# Altium project Bad-Fox Prototype.PrjPcb
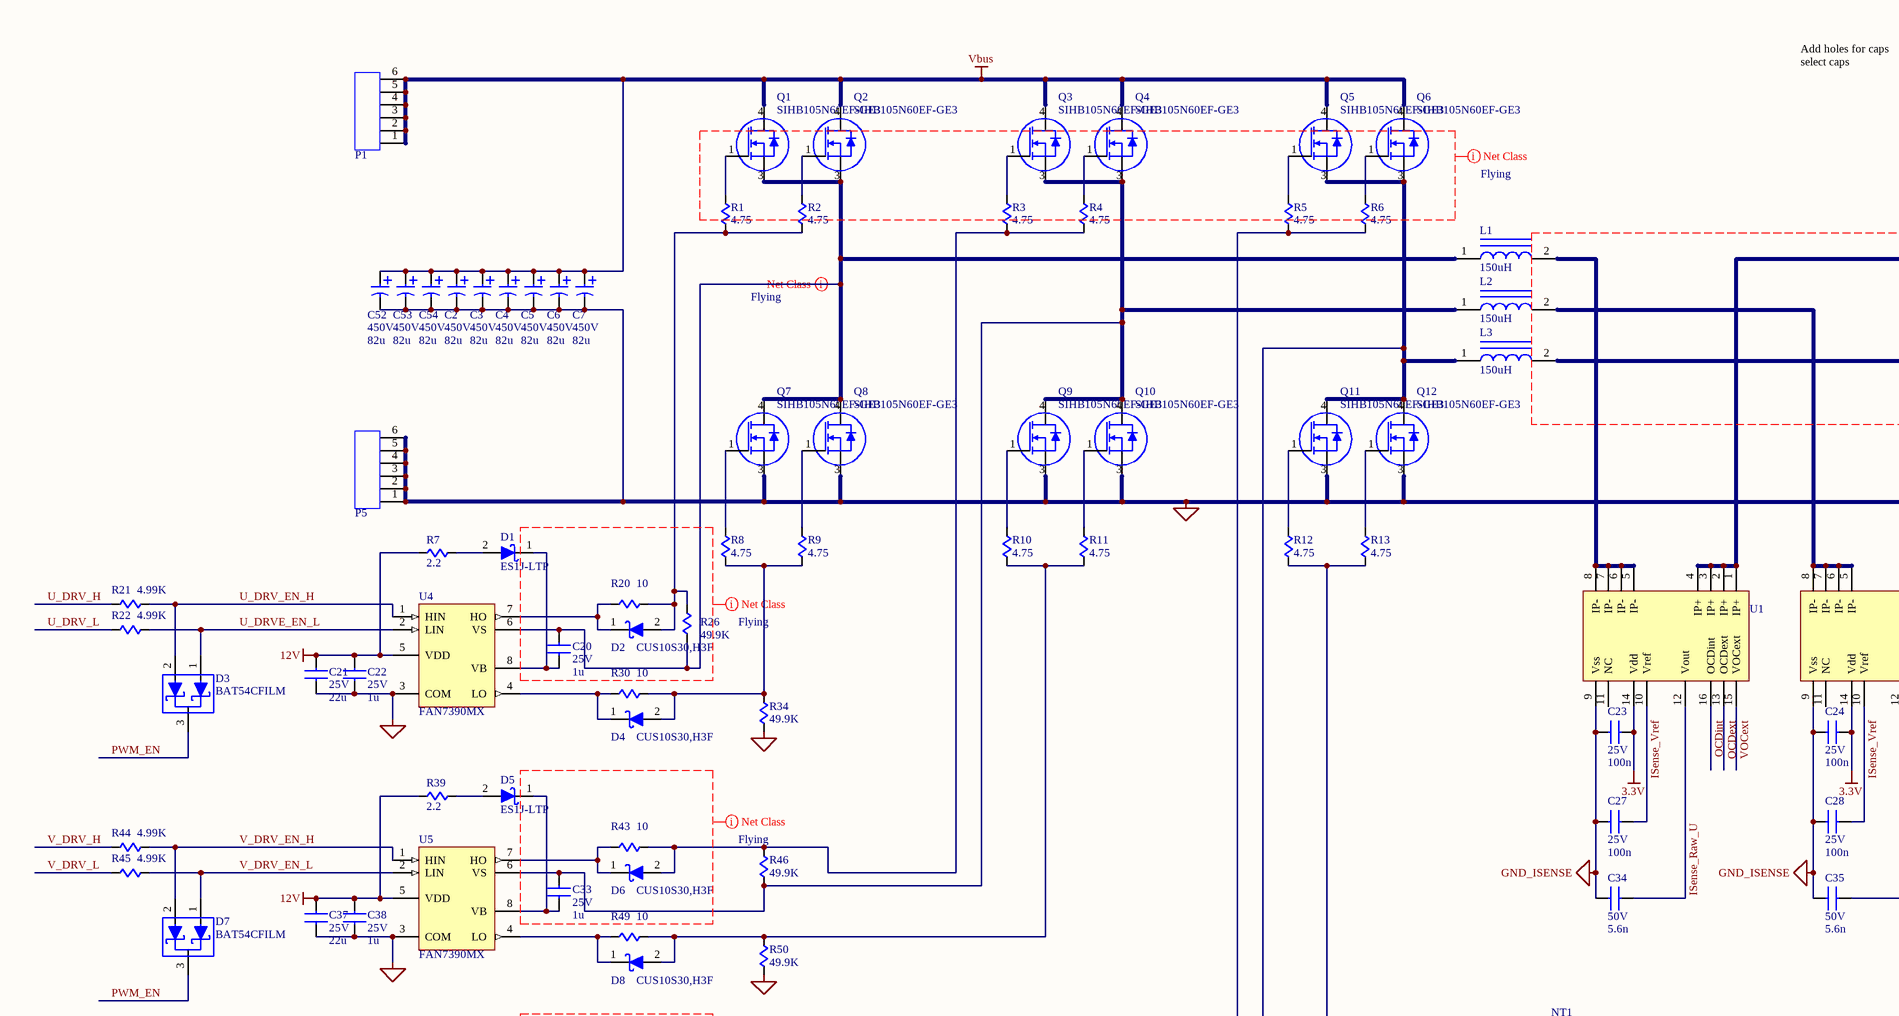
[diagram p0: Bad-Fox Prototype.SchDoc, top left]
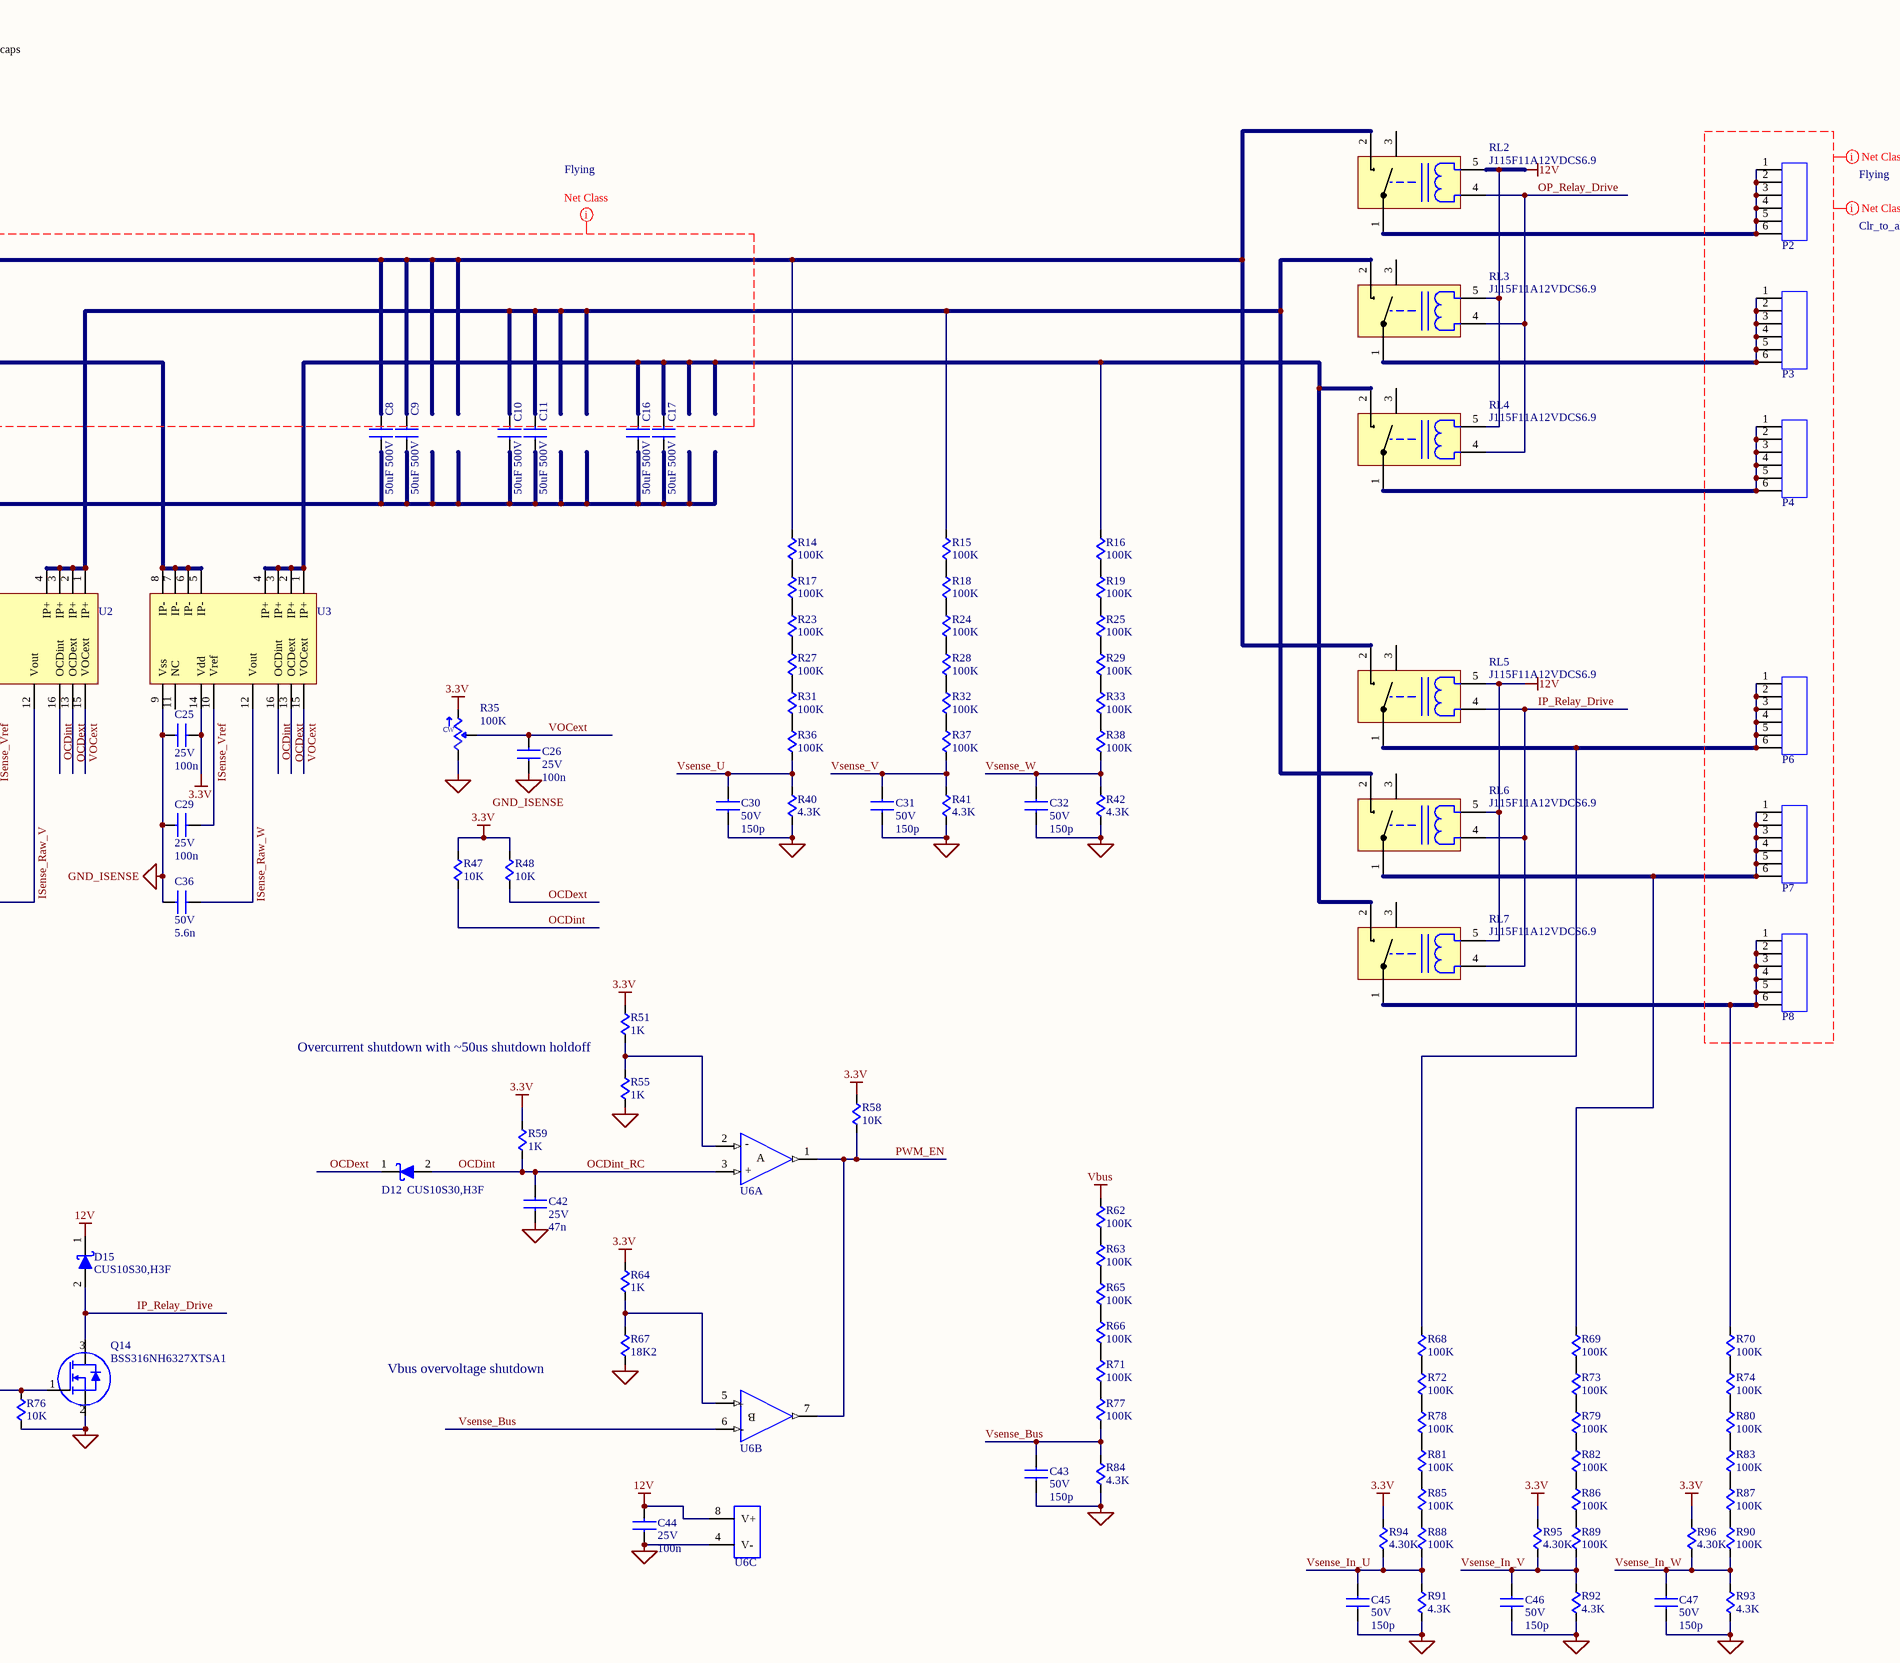
[diagram p1: Bad-Fox Prototype.SchDoc, top right]
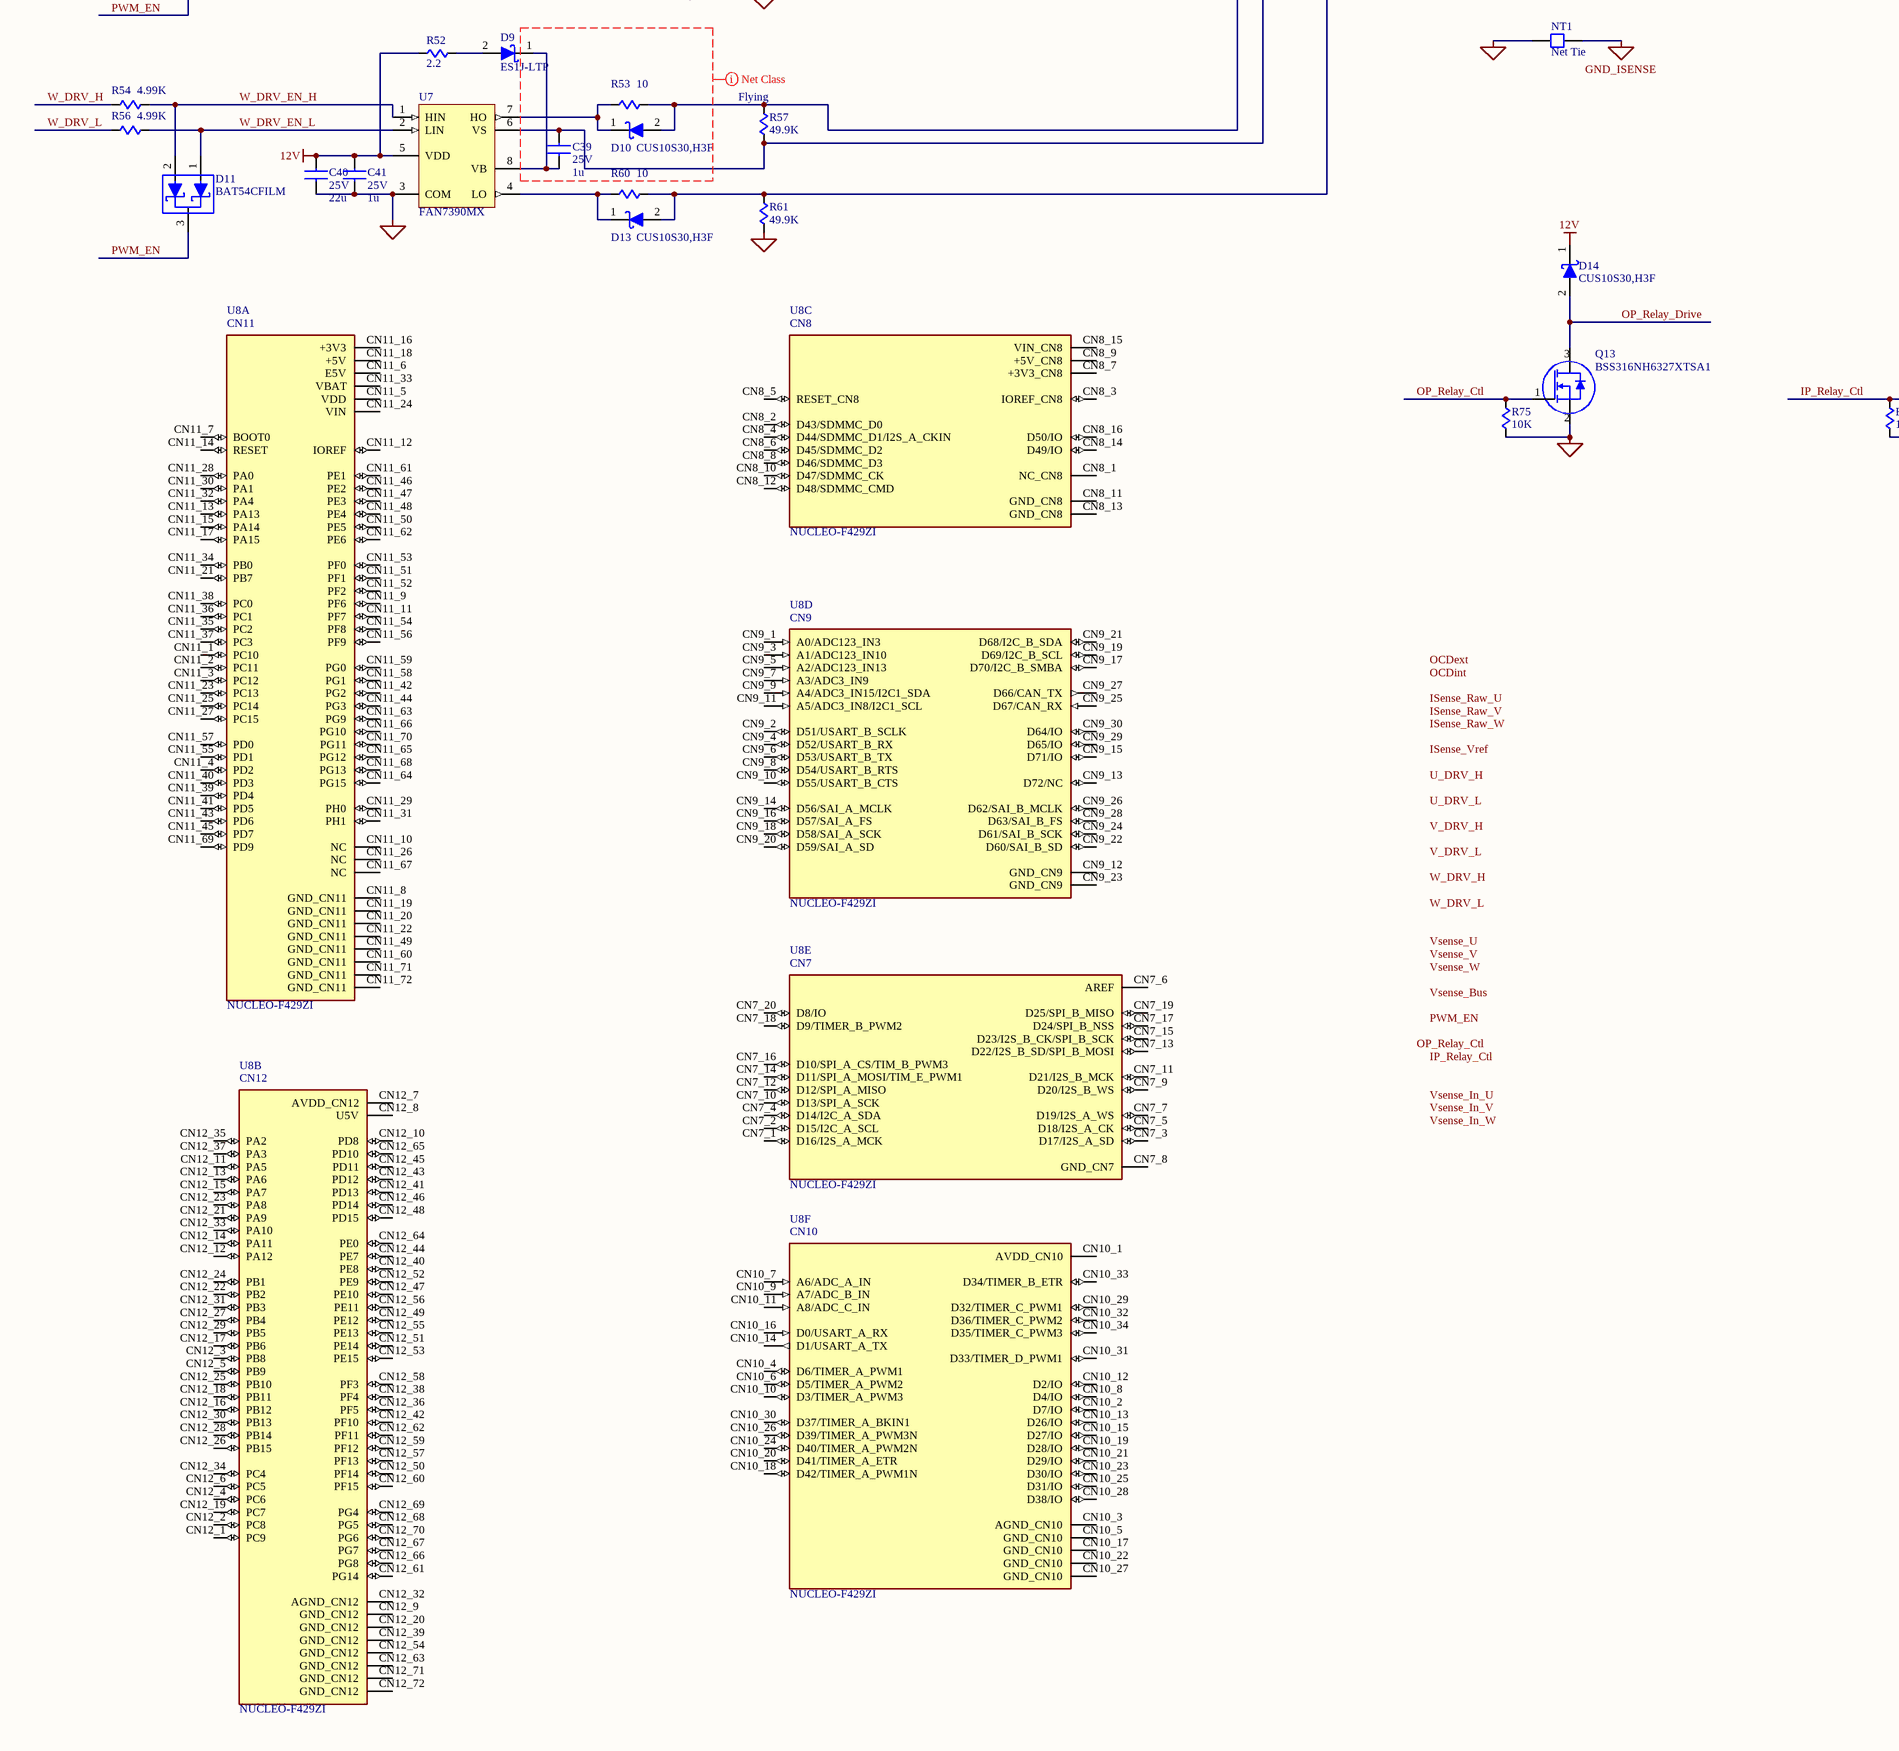
[diagram p2: Bad-Fox Prototype.SchDoc, bottom left]
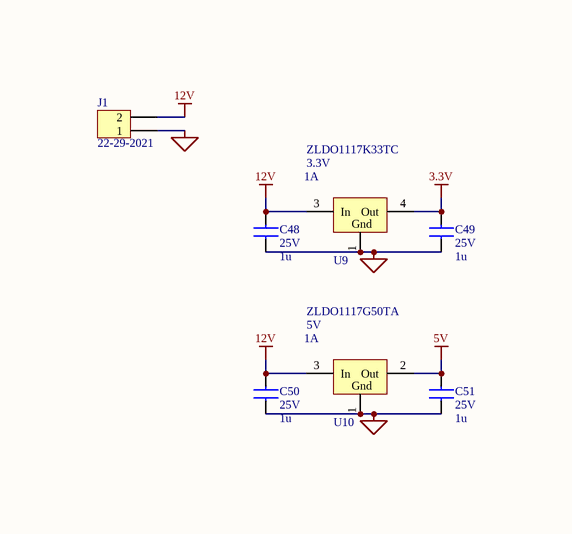
[diagram p3: Bad-Fox Prototype.SchDoc, bottom right]
1 sheet, 201 parts. Net scope: global (net labels, ports and power ports of the same name join across sheets).
Board file: Bad-Fox Prototype.PcbDoc

## Sheet Bad-Fox Prototype.SchDoc
size A1

### Parts
C2  Voltage Rating: 450V  [CAPPR7.5-18X35.5]  (hidden comment: 82u)
C3  Voltage Rating: 450V  [CAPPR7.5-18X35.5]  (hidden comment: 82u)
C4  Voltage Rating: 450V  [CAPPR7.5-18X35.5]  (hidden comment: 82u)
C5  Voltage Rating: 450V  [CAPPR7.5-18X35.5]  (hidden comment: 82u)
C6  Voltage Rating: 450V  [CAPPR7.5-18X35.5]  (hidden comment: 82u)
C7  Voltage Rating: 450V  [CAPPR7.5-18X35.5]  (hidden comment: 82u)
C8  value 50uF 500V  [C4AQ]  (hidden comment: Cap Film PP 50u 500V RADIAL)
C9  value 50uF 500V  [C4AQ]  (hidden comment: Cap Film PP 50u 500V RADIAL)
C10  value 50uF 500V  [C4AQ]  (hidden comment: Cap Film PP 50u 500V RADIAL)
C11  value 50uF 500V  [C4AQ]  (hidden comment: Cap Film PP 50u 500V RADIAL)
C16  value 50uF 500V  [C4AQ]  (hidden comment: Cap Film PP 50u 500V RADIAL)
C17  value 50uF 500V  [C4AQ]  (hidden comment: Cap Film PP 50u 500V RADIAL)
C20  Voltage Rating: 25V  [CAPC1608N-0603]  (hidden comment: 1u)
C21  Voltage Rating: 25V  [CAPC3216N-1206]  (hidden comment: 22u)
C22  Voltage Rating: 25V  [CAPC1608N-0603]  (hidden comment: 1u)
C23  Voltage Rating: 25V  [CAPC1608N-0603]  (hidden comment: 100n)
C24  Voltage Rating: 25V  [CAPC1608N-0603]  (hidden comment: 100n)
C25  Voltage Rating: 25V  [CAPC1608N-0603]  (hidden comment: 100n)
C26  Voltage Rating: 25V  [CAPC1608N-0603]  (hidden comment: 100n)
C27  Voltage Rating: 25V  [CAPC1608N-0603]  (hidden comment: 100n)
C28  Voltage Rating: 25V  [CAPC1608N-0603]  (hidden comment: 100n)
C29  Voltage Rating: 25V  [CAPC1608N-0603]  (hidden comment: 100n)
C30  Voltage Rating: 50V  [CAPC1608N-0603]  (hidden comment: 150p)
C31  Voltage Rating: 50V  [CAPC1608N-0603]  (hidden comment: 150p)
C32  Voltage Rating: 50V  [CAPC1608N-0603]  (hidden comment: 150p)
C33  Voltage Rating: 25V  [CAPC1608N-0603]  (hidden comment: 1u)
C34  Voltage Rating: 50V  [CAPC1608N-0603]  (hidden comment: 5.6n)
C35  Voltage Rating: 50V  [CAPC1608N-0603]  (hidden comment: 5.6n)
C36  Voltage Rating: 50V  [CAPC1608N-0603]  (hidden comment: 5.6n)
C37  Voltage Rating: 25V  [CAPC3216N-1206]  (hidden comment: 22u)
C38  Voltage Rating: 25V  [CAPC1608N-0603]  (hidden comment: 1u)
C39  Voltage Rating: 25V  [CAPC1608N-0603]  (hidden comment: 1u)
C40  Voltage Rating: 25V  [CAPC3216N-1206]  (hidden comment: 22u)
C41  Voltage Rating: 25V  [CAPC1608N-0603]  (hidden comment: 1u)
C42  Voltage Rating: 25V  [CAPC1608N-0603]  (hidden comment: 47n)
C43  Voltage Rating: 50V  [CAPC1608N-0603]  (hidden comment: 150p)
C44  Voltage Rating: 25V  [CAPC1608N-0603]  (hidden comment: 100n)
C45  Voltage Rating: 50V  [CAPC1608N-0603]  (hidden comment: 150p)
C46  Voltage Rating: 50V  [CAPC1608N-0603]  (hidden comment: 150p)
C47  Voltage Rating: 50V  [CAPC1608N-0603]  (hidden comment: 150p)
C48  Voltage Rating: 25V  [CAPC1608N-0603]  (hidden comment: 1u)
C49  Voltage Rating: 25V  [CAPC1608N-0603]  (hidden comment: 1u)
C50  Voltage Rating: 25V  [CAPC1608N-0603]  (hidden comment: 1u)
C51  Voltage Rating: 25V  [CAPC1608N-0603]  (hidden comment: 1u)
C52  Voltage Rating: 450V  [CAPPR7.5-18X35.5]  (hidden comment: 82u)
C53  Voltage Rating: 450V  [CAPPR7.5-18X35.5]  (hidden comment: 82u)
C54  Voltage Rating: 450V  [CAPPR7.5-18X35.5]  (hidden comment: 82u)
D1  ES1J-LTP  [DIODE SMA]
D2  CUS10S30,H3F  [SOD-323]
D3  BAT54CFILM  [SOT23-3N]
D4  CUS10S30,H3F  [SOD-323]
D5  ES1J-LTP  [DIODE SMA]
D6  CUS10S30,H3F  [SOD-323]
D7  BAT54CFILM  [SOT23-3N]
D8  CUS10S30,H3F  [SOD-323]
D9  ES1J-LTP  [DIODE SMA]
D10  CUS10S30,H3F  [SOD-323]
D11  BAT54CFILM  [SOT23-3N]
D12  CUS10S30,H3F  [SOD-323]
D13  CUS10S30,H3F  [SOD-323]
D14  CUS10S30,H3F  [SOD-323]
D15  CUS10S30,H3F  [SOD-323]
J1  22-29-2021  [CONN HEADER 2-PIN KK 6410]
L1  value 150uH  [BF_IND]  (hidden comment: Inductor for inverter charger (placeholder))
L2  value 150uH  [BF_IND]  (hidden comment: Inductor for inverter charger (placeholder))
L3  value 150uH  [BF_IND]  (hidden comment: Inductor for inverter charger (placeholder))
NT1  Net Tie  [NET TIE 50MIL]  (net tie, no BOM)
P1  Conn Screw Term PCB  [CONN SCREW TERM PCB]  (value not drawn)
P2  Conn Screw Term PCB  [CONN SCREW TERM PCB]  (value not drawn)
P3  Conn Screw Term PCB  [CONN SCREW TERM PCB]  (value not drawn)
P4  Conn Screw Term PCB  [CONN SCREW TERM PCB]  (value not drawn)
P5  Conn Screw Term PCB  [CONN SCREW TERM PCB]  (value not drawn)
P6  Conn Screw Term PCB  [CONN SCREW TERM PCB]  (value not drawn)
P7  Conn Screw Term PCB  [CONN SCREW TERM PCB]  (value not drawn)
P8  Conn Screw Term PCB  [CONN SCREW TERM PCB]  (value not drawn)
Q1  value SIHB105N60EF-GE3  [TO263]  (hidden comment: Tran N-MOSFET 600V 29A 105mOhm D2-PAK)
Q2  value SIHB105N60EF-GE3  [TO263]  (hidden comment: Tran N-MOSFET 600V 29A 105mOhm D2-PAK)
Q3  value SIHB105N60EF-GE3  [TO263]  (hidden comment: Tran N-MOSFET 600V 29A 105mOhm D2-PAK)
Q4  value SIHB105N60EF-GE3  [TO263]  (hidden comment: Tran N-MOSFET 600V 29A 105mOhm D2-PAK)
Q5  value SIHB105N60EF-GE3  [TO263]  (hidden comment: Tran N-MOSFET 600V 29A 105mOhm D2-PAK)
Q6  value SIHB105N60EF-GE3  [TO263]  (hidden comment: Tran N-MOSFET 600V 29A 105mOhm D2-PAK)
Q7  value SIHB105N60EF-GE3  [TO263]  (hidden comment: Tran N-MOSFET 600V 29A 105mOhm D2-PAK)
Q8  value SIHB105N60EF-GE3  [TO263]  (hidden comment: Tran N-MOSFET 600V 29A 105mOhm D2-PAK)
Q9  value SIHB105N60EF-GE3  [TO263]  (hidden comment: Tran N-MOSFET 600V 29A 105mOhm D2-PAK)
Q10  value SIHB105N60EF-GE3  [TO263]  (hidden comment: Tran N-MOSFET 600V 29A 105mOhm D2-PAK)
Q11  value SIHB105N60EF-GE3  [TO263]  (hidden comment: Tran N-MOSFET 600V 29A 105mOhm D2-PAK)
Q12  value SIHB105N60EF-GE3  [TO263]  (hidden comment: Tran N-MOSFET 600V 29A 105mOhm D2-PAK)
Q13  value BSS316NH6327XTSA1  [SOT23-3N]  (hidden comment: Tran N-MOSFET 30V 1.4A SOT-23)
Q14  value BSS316NH6327XTSA1  [SOT23-3N]  (hidden comment: Tran N-MOSFET 30V 1.4A SOT-23)
R1  4.75  [RESC1608N-0603]
R2  4.75  [RESC1608N-0603]
R3  4.75  [RESC1608N-0603]
R4  4.75  [RESC1608N-0603]
R5  4.75  [RESC1608N-0603]
R6  4.75  [RESC1608N-0603]
R7  2.2  [RESC1608N-0603]
R8  4.75  [RESC1608N-0603]
R9  4.75  [RESC1608N-0603]
R10  4.75  [RESC1608N-0603]
R11  4.75  [RESC1608N-0603]
R12  4.75  [RESC1608N-0603]
R13  4.75  [RESC1608N-0603]
R14  100K  [RESC1608N-0603]
R15  100K  [RESC1608N-0603]
R16  100K  [RESC1608N-0603]
R17  100K  [RESC1608N-0603]
R18  100K  [RESC1608N-0603]
R19  100K  [RESC1608N-0603]
R20  10  [RESC1608N-0603]
R21  4.99K  [RESC1608N-0603]
R22  4.99K  [RESC1608N-0603]
R23  100K  [RESC1608N-0603]
R24  100K  [RESC1608N-0603]
R25  100K  [RESC1608N-0603]
R26  49.9K  [RESC1608N-0603]
R27  100K  [RESC1608N-0603]
R28  100K  [RESC1608N-0603]
R29  100K  [RESC1608N-0603]
R30  10  [RESC1608N-0603]
R31  100K  [RESC1608N-0603]
R32  100K  [RESC1608N-0603]
R33  100K  [RESC1608N-0603]
R34  49.9K  [RESC1608N-0603]
R35  100K  [PTV09A-2020F-B104]
R36  100K  [RESC1608N-0603]
R37  100K  [RESC1608N-0603]
R38  100K  [RESC1608N-0603]
R39  2.2  [RESC1608N-0603]
R40  4.3K  [RESC1608N-0603]
R41  4.3K  [RESC1608N-0603]
R42  4.3K  [RESC1608N-0603]
R43  10  [RESC1608N-0603]
R44  4.99K  [RESC1608N-0603]
R45  4.99K  [RESC1608N-0603]
R46  49.9K  [RESC1608N-0603]
R47  10K  [RESC1608N-0603]
R48  10K  [RESC1608N-0603]
R49  10  [RESC1608N-0603]
R50  49.9K  [RESC1608N-0603]
R51  1K  [RESC1608N-0603]
R52  2.2  [RESC1608N-0603]
R53  10  [RESC1608N-0603]
R54  4.99K  [RESC1608N-0603]
R55  1K  [RESC1608N-0603]
R56  4.99K  [RESC1608N-0603]
R57  49.9K  [RESC1608N-0603]
R58  10K  [RESC1608N-0603]
R59  1K  [RESC1608N-0603]
R60  10  [RESC1608N-0603]
R61  49.9K  [RESC1608N-0603]
R62  100K  [RESC1608N-0603]
R63  100K  [RESC1608N-0603]
R64  1K  [RESC1608N-0603]
R65  100K  [RESC1608N-0603]
R66  100K  [RESC1608N-0603]
R67  value 18K2  [RESC1608N-0603]  (hidden comment: Res 18.2K 1/10W 1% 0603)
R68  100K  [RESC1608N-0603]
R69  100K  [RESC1608N-0603]
R70  100K  [RESC1608N-0603]
R71  100K  [RESC1608N-0603]
R72  100K  [RESC1608N-0603]
R73  100K  [RESC1608N-0603]
R74  100K  [RESC1608N-0603]
R75  10K  [RESC1608N-0603]
R76  10K  [RESC1608N-0603]
R77  100K  [RESC1608N-0603]
R78  100K  [RESC1608N-0603]
R79  100K  [RESC1608N-0603]
R80  100K  [RESC1608N-0603]
R81  100K  [RESC1608N-0603]
R82  100K  [RESC1608N-0603]
R83  100K  [RESC1608N-0603]
R84  4.3K  [RESC1608N-0603]
R85  100K  [RESC1608N-0603]
R86  100K  [RESC1608N-0603]
R87  100K  [RESC1608N-0603]
R88  100K  [RESC1608N-0603]
R89  100K  [RESC1608N-0603]
R90  100K  [RESC1608N-0603]
R91  4.3K  [RESC1608N-0603]
R92  4.3K  [RESC1608N-0603]
R93  4.3K  [RESC1608N-0603]
R94  value 4.30K  [RESC1608N-0603]  (hidden comment: Res 4.30K 1/10W 1% 0603)
R95  value 4.30K  [RESC1608N-0603]  (hidden comment: Res 4.30K 1/10W 1% 0603)
R96  value 4.30K  [RESC1608N-0603]  (hidden comment: Res 4.30K 1/10W 1% 0603)
RL2  value J115F11A12VDCS6.9  [T9A]  (hidden comment: Relay SPST 277VAC 40A 12Vcoil)
RL3  value J115F11A12VDCS6.9  [T9A]  (hidden comment: Relay SPST 277VAC 40A 12Vcoil)
RL4  value J115F11A12VDCS6.9  [T9A]  (hidden comment: Relay SPST 277VAC 40A 12Vcoil)
RL5  value J115F11A12VDCS6.9  [T9A]  (hidden comment: Relay SPST 277VAC 40A 12Vcoil)
RL6  value J115F11A12VDCS6.9  [T9A]  (hidden comment: Relay SPST 277VAC 40A 12Vcoil)
RL7  value J115F11A12VDCS6.9  [T9A]  (hidden comment: Relay SPST 277VAC 40A 12Vcoil)
U1  IC Sensor Current Isolated 75A  [SOIC127P1030X264-16N]  (value not drawn)
U2  IC Sensor Current Isolated 75A  [SOIC127P1030X264-16N]  (value not drawn)
U3  IC Sensor Current Isolated 75A  [SOIC127P1030X264-16N]  (value not drawn)
U4  value FAN7390MX  [SOIC127P600-8N]  (hidden comment: IC Fet Driver 4.5A Half Bridge)
U5  value FAN7390MX  [SOIC127P600-8N]  (hidden comment: IC Fet Driver 4.5A Half Bridge)
U6  IC Comparator Open Drain Dual 8-SOIC  [SOIC127P600-8N]  (value not drawn)  (parts A,B,C of 3)
U7  value FAN7390MX  [SOIC127P600-8N]  (hidden comment: IC Fet Driver 4.5A Half Bridge)
U8  NUCLEO-F429ZI  [MODULE_NUCLEO-F429ZI]  (parts A,B,C,D,E,F of 6)
U9  Voltage - Output: 3.3V  Current - Output: 1A  [TO252-229P970-3N]  (hidden comment: ZLDO1117K33TC)
U10  Voltage - Output: 5V  Current - Output: 1A  [SOT223-4N]  (hidden comment: ZLDO1117G50TA)

### Nets
3.3V: C23.1 C24.1 C25.1 C49.1 R35.3 R47.2 R48.2 R51.2 R58.2 R59.2 R64.2 R94.2 R95.2 R96.2 U1.14(Vdd) U2.14(Vdd) U3.14(Vdd) U9.4(Out)
5V: C51.1 U10.2(Out)
12V: C21.1 C22.1 C37.1 C38.1 C40.1 C41.1 C44.1 C48.1 C50.1 D14.1(Cathode) D15.1(Cathode) J1.2 R7.1 R39.1 R52.1 RL2.5 RL3.5 RL4.5 RL5.5 RL6.5 RL7.5 U4.5(VDD) U5.5(VDD) U6.8(V+) U7.5(VDD) U9.3(In) U10.3(In)
GND: C2.2 C3.2 C4.2 C5.2 C6.2 C7.2 C8.2 C9.2 C10.2 C11.2 C16.2 C17.2 C21.2 C22.2 C30.2 C31.2 C32.2 C37.2 C38.2 C40.2 C41.2 C42.2 C43.2 C44.2 C45.2 C46.2 C47.2 C48.2 C49.2 C50.2 C51.2 C52.2 C53.2 C54.2 J1.1 NT1.1 P5.1 P5.2 P5.3 P5.4 P5.5 P5.6 Q7.3(Source) Q8.3(Source) Q9.3(Source) Q10.3(Source) Q11.3(Source) Q12.3(Source) Q13.2(Source) Q14.2(Source) R34.1 R35.1 R40.1 R41.1 R42.1 R50.1 R55.1 R61.1 R67.1 R75.1 R76.1 R84.1 R91.1 R92.1 R93.1 U4.3(COM) U5.3(COM) U6.4(V-) U7.3(COM) U9.1(Gnd) U10.1(Gnd)
GND_ISENSE: C23.2 C24.2 C25.2 C26.2 C27.2 C28.2 C29.2 C34.1 C35.1 C36.1 NT1.2 U1.9(Vss) U2.9(Vss) U3.9(Vss)
Vbus: C2.1 C3.1 C4.1 C5.1 C6.1 C7.1 C52.1 C53.1 C54.1 P1.1 P1.2 P1.3 P1.4 P1.5 P1.6 Q1.4(Drain) Q2.4(Drain) Q3.4(Drain) Q4.4(Drain) Q5.4(Drain) Q6.4(Drain) R62.2
IP_Relay_Ctl: Q14.1(Gate) R76.2
IP_Relay_Drive: D15.2(Anode) Q14.3(Drain) RL5.4 RL6.4 RL7.4
ISense_Raw_U: C34.2 U1.12(Vout)
ISense_Raw_V: C35.2 U2.12(Vout)
ISense_Raw_W: C36.2 U3.12(Vout)
ISense_Vref: C27.1 C28.1 C29.1 U1.10(Vref) U2.10(Vref) U3.10(Vref)
OCDext: D12.1(Cathode) R48.1 U1.13(OCDext) U2.13(OCDext) U3.13(OCDext)
OCDint: C42.1 D12.2(Anode) R47.1 R59.1 U1.16(OCDint) U2.16(OCDint) U3.16(OCDint) U6.3(+A)  [also labelled OCDint_RC]
OP_Relay_Ctl: Q13.1(Gate) R75.2
OP_Relay_Drive: D14.2(Anode) Q13.3(Drain) RL2.4 RL3.4 RL4.4
PWM_EN: D3.3(Cathode) D7.3(Cathode) D11.3(Cathode) R58.1 U6.1(Output_A) U6.7(Output_B)
U_DRV_EN_H: D3.2(Anode2) R21.2 U4.1(HIN)
U_DRV_H: R21.1
U_DRV_L: R22.1
U_DRVE_EN_L: D3.1(Anode1) R22.2 U4.2(LIN)
V_DRV_EN_H: D7.2(Anode2) R44.2 U5.1(HIN)
V_DRV_EN_L: D7.1(Anode1) R45.2 U5.2(LIN)
V_DRV_H: R44.1
V_DRV_L: R45.1
VOCext: C26.1 R35.2 U1.15(VOCext) U2.15(VOCext) U3.15(VOCext)
Vsense_Bus: C43.1 R77.1 R84.2 U6.6(-B)
Vsense_In_U: C45.1 R88.1 R91.2 R94.1
Vsense_In_V: C46.1 R89.1 R92.2 R95.1
Vsense_In_W: C47.1 R90.1 R93.2 R96.1
Vsense_U: C30.1 R36.1 R40.2
Vsense_V: C31.1 R37.1 R41.2
Vsense_W: C32.1 R38.1 R42.2
W_DRV_EN_H: D11.2(Anode2) R54.2 U7.1(HIN)
W_DRV_EN_L: D11.1(Anode1) R56.2 U7.2(LIN)
W_DRV_H: R54.1
W_DRV_L: R56.1
NetC8_1: C8.1 C9.1 R14.2 RL2.2 RL5.2 U1.1(IP+) U1.2(IP+) U1.3(IP+) U1.4(IP+)
NetC10_1: C10.1 C11.1 R15.2 RL3.2 RL6.2 U2.1(IP+) U2.2(IP+) U2.3(IP+) U2.4(IP+)
NetC16_1: C16.1 C17.1 R16.2 RL4.2 RL7.2 U3.1(IP+) U3.2(IP+) U3.3(IP+) U3.4(IP+)
NetC20_1: C20.1 D1.1(Cathode) U4.8(VB)
NetC20_2: C20.2 L1.1 Q1.3(Source) Q2.3(Source) Q7.4(Drain) Q8.4(Drain) R26.1 U4.6(VS)
NetC33_1: C33.1 D5.1(Cathode) U5.8(VB)
NetC33_2: C33.2 L2.1 Q3.3(Source) Q4.3(Source) Q9.4(Drain) Q10.4(Drain) R46.1 U5.6(VS)
NetC39_1: C39.1 D9.1(Cathode) U7.8(VB)
NetC39_2: C39.2 L3.1 Q5.3(Source) Q6.3(Source) Q11.4(Drain) Q12.4(Drain) R57.1 U7.6(VS)
NetD1_2: D1.2(Anode) R7.2
NetD2_1: D2.1(Cathode) R20.1 U4.7(HO)
NetD2_2: D2.2(Anode) R1.2 R2.2 R20.2 R26.2
NetD4_1: D4.1(Cathode) R30.1 U4.4(LO)
NetD4_2: D4.2(Anode) R8.2 R9.2 R30.2 R34.2
NetD5_2: D5.2(Anode) R39.2
NetD6_1: D6.1(Cathode) R43.1 U5.7(HO)
NetD6_2: D6.2(Anode) R3.2 R4.2 R43.2 R46.2
NetD8_1: D8.1(Cathode) R49.1 U5.4(LO)
NetD8_2: D8.2(Anode) R10.2 R11.2 R49.2 R50.2
NetD9_2: D9.2(Anode) R52.2
NetD10_1: D10.1(Cathode) R53.1 U7.7(HO)
NetD10_2: D10.2(Anode) R5.2 R6.2 R53.2 R57.2
NetD13_1: D13.1(Cathode) R60.1 U7.4(LO)
NetD13_2: D13.2(Anode) R12.2 R13.2 R60.2 R61.2
NetL1_2: L1.2 U1.5(IP-) U1.6(IP-) U1.7(IP-) U1.8(IP-)
NetL2_2: L2.2 U2.5(IP-) U2.6(IP-) U2.7(IP-) U2.8(IP-)
NetL3_2: L3.2 U3.5(IP-) U3.6(IP-) U3.7(IP-) U3.8(IP-)
NetP2_1: P2.1 P2.2 P2.3 P2.4 P2.5 P2.6 RL2.1
NetP3_1: P3.1 P3.2 P3.3 P3.4 P3.5 P3.6 RL3.1
NetP4_1: P4.1 P4.2 P4.3 P4.4 P4.5 P4.6 RL4.1
NetP6_1: P6.1 P6.2 P6.3 P6.4 P6.5 P6.6 R68.2 RL5.1
NetP7_1: P7.1 P7.2 P7.3 P7.4 P7.5 P7.6 R69.2 RL6.1
NetP8_1: P8.1 P8.2 P8.3 P8.4 P8.5 P8.6 R70.2 RL7.1
NetQ1_1: Q1.1(Gate) R1.1
NetQ2_1: Q2.1(Gate) R2.1
NetQ3_1: Q3.1(Gate) R3.1
NetQ4_1: Q4.1(Gate) R4.1
NetQ5_1: Q5.1(Gate) R5.1
NetQ6_1: Q6.1(Gate) R6.1
NetQ7_1: Q7.1(Gate) R8.1
NetQ8_1: Q8.1(Gate) R9.1
NetQ9_1: Q9.1(Gate) R10.1
NetQ10_1: Q10.1(Gate) R11.1
NetQ11_1: Q11.1(Gate) R12.1
NetQ12_1: Q12.1(Gate) R13.1
NetR14_1: R14.1 R17.2
NetR15_1: R15.1 R18.2
NetR16_1: R16.1 R19.2
NetR17_1: R17.1 R23.2
NetR18_1: R18.1 R24.2
NetR19_1: R19.1 R25.2
NetR23_1: R23.1 R27.2
NetR24_1: R24.1 R28.2
NetR25_1: R25.1 R29.2
NetR27_1: R27.1 R31.2
NetR28_1: R28.1 R32.2
NetR29_1: R29.1 R33.2
NetR31_1: R31.1 R36.2
NetR32_1: R32.1 R37.2
NetR33_1: R33.1 R38.2
NetR51_1: R51.1 R55.2 U6.2(-A)
NetR62_1: R62.1 R63.2
NetR63_1: R63.1 R65.2
NetR64_1: R64.1 R67.2 U6.5(+B)
NetR65_1: R65.1 R66.2
NetR66_1: R66.1 R71.2
NetR68_1: R68.1 R72.2
NetR69_1: R69.1 R73.2
NetR70_1: R70.1 R74.2
NetR71_1: R71.1 R77.2
NetR72_1: R72.1 R78.2
NetR73_1: R73.1 R79.2
NetR74_1: R74.1 R80.2
NetR78_1: R78.1 R81.2
NetR79_1: R79.1 R82.2
NetR80_1: R80.1 R83.2
NetR81_1: R81.1 R85.2
NetR82_1: R82.1 R86.2
NetR83_1: R83.1 R87.2
NetR85_1: R85.1 R88.2
NetR86_1: R86.1 R89.2
NetR87_1: R87.1 R90.2

Not connected (* = marked no-connect by the designer): RL2 3; RL3 3; RL4 3; RL5 3; RL6 3; RL7 3; U1 11(NC); U2 11(NC); U3 11(NC); U8 CN7_1(D16/I2S_A_MCK) CN7_2(D15/I2C_A_SCL) CN7_3(D17/I2S_A_SD) CN7_4(D14/I2C_A_SDA) CN7_5(D18/I2S_A_CK) CN7_6(AREF) CN7_7(D19/I2S_A_WS) CN7_8(GND_CN7) CN7_9(D20/I2S_B_WS) CN7_10(D13/SPI_A_SCK) CN7_11(D21/I2S_B_MCK) CN7_12(D12/SPI_A_MISO) CN7_13(D22/I2S_B_SD/SPI_B_MOSI) CN7_14(D11/SPI_A_MOSI/TIM_E_PWM1) CN7_15(D23/I2S_B_CK/SPI_B_SCK) CN7_16(D10/SPI_A_CS/TIM_B_PWM3) CN7_17(D24/SPI_B_NSS) CN7_18(D9/TIMER_B_PWM2) CN7_19(D25/SPI_B_MISO) CN7_20(D8/IO) CN8_1(NC_CN8) CN8_2(D43/SDMMC_D0) CN8_3(IOREF_CN8) CN8_4(D44/SDMMC_D1/I2S_A_CKIN) CN8_5(RESET_CN8) CN8_6(D45/SDMMC_D2) CN8_7(+3V3_CN8) CN8_8(D46/SDMMC_D3) CN8_9(+5V_CN8) CN8_10(D47/SDMMC_CK) CN8_11(GND_CN8) CN8_12(D48/SDMMC_CMD) CN8_13(GND_CN8) CN8_14(D49/IO) CN8_15(VIN_CN8) CN8_16(D50/IO) CN9_1(A0/ADC123_IN3) CN9_2(D51/USART_B_SCLK) CN9_3(A1/ADC123_IN10) CN9_4(D52/USART_B_RX) CN9_5(A2/ADC123_IN13) CN9_6(D53/USART_B_TX) CN9_7(A3/ADC3_IN9) CN9_8(D54/USART_B_RTS) CN9_9(A4/ADC3_IN15/I2C1_SDA) CN9_10(D55/USART_B_CTS) CN9_11(A5/ADC3_IN8/I2C1_SCL) CN9_12(GND_CN9) CN9_13(D72/NC) CN9_14(D56/SAI_A_MCLK) CN9_15(D71/IO) CN9_16(D57/SAI_A_FS) CN9_17(D70/I2C_B_SMBA) CN9_18(D58/SAI_A_SCK) CN9_19(D69/I2C_B_SCL) CN9_20(D59/SAI_A_SD) CN9_21(D68/I2C_B_SDA) CN9_22(D60/SAI_B_SD) CN9_23(GND_CN9) CN9_24(D61/SAI_B_SCK) CN9_25(D67/CAN_RX) CN9_26(D62/SAI_B_MCLK) CN9_27(D66/CAN_TX) CN9_28(D63/SAI_B_FS) CN9_29(D65/IO) CN9_30(D64/IO) CN10_1(AVDD_CN10) CN10_2(D7/IO) CN10_3(AGND_CN10) CN10_4(D6/TIMER_A_PWM1) CN10_5(GND_CN10) CN10_6(D5/TIMER_A_PWM2) CN10_7(A6/ADC_A_IN) CN10_8(D4/IO) CN10_9(A7/ADC_B_IN) CN10_10(D3/TIMER_A_PWM3) CN10_11(A8/ADC_C_IN) CN10_12(D2/IO) CN10_13(D26/IO) CN10_14(D1/USART_A_TX) CN10_15(D27/IO) CN10_16(D0/USART_A_RX) CN10_17(GND_CN10) CN10_18(D42/TIMER_A_PWM1N) CN10_19(D28/IO) CN10_20(D41/TIMER_A_ETR) CN10_21(D29/IO) CN10_22(GND_CN10) CN10_23(D30/IO) CN10_24(D40/TIMER_A_PWM2N) CN10_25(D31/IO) CN10_26(D39/TIMER_A_PWM3N) CN10_27(GND_CN10) CN10_28(D38/IO) CN10_29(D32/TIMER_C_PWM1) CN10_30(D37/TIMER_A_BKIN1) CN10_31(D33/TIMER_D_PWM1) CN10_32(D36/TIMER_C_PWM2) CN10_33(D34/TIMER_B_ETR) CN10_34(D35/TIMER_C_PWM3) CN11_1(PC10) CN11_2(PC11) CN11_3(PC12) CN11_4(PD2) CN11_5(VDD) CN11_6(E5V) CN11_7(BOOT0) CN11_8(GND_CN11) CN11_9(PF6) CN11_10(NC) CN11_11(PF7) CN11_12(IOREF) CN11_13(PA13) CN11_14(RESET) CN11_15(PA14) CN11_16(+3V3) CN11_17(PA15) CN11_18(+5V) CN11_19(GND_CN11) CN11_20(GND_CN11) CN11_21(PB7) CN11_22(GND_CN11) CN11_23(PC13) CN11_24(VIN) CN11_25(PC14) CN11_26(NC) CN11_27(PC15) CN11_28(PA0) CN11_29(PH0) CN11_30(PA1) CN11_31(PH1) CN11_32(PA4) CN11_33(VBAT) CN11_34(PB0) CN11_35(PC2) CN11_36(PC1) CN11_37(PC3) CN11_38(PC0) CN11_39(PD4) CN11_40(PD3) CN11_41(PD5) CN11_42(PG2) CN11_43(PD6) CN11_44(PG3) CN11_45(PD7) CN11_46(PE2) CN11_47(PE3) CN11_48(PE4) CN11_49(GND_CN11) CN11_50(PE5) CN11_51(PF1) CN11_52(PF2) CN11_53(PF0) CN11_54(PF8) CN11_55(PD1) CN11_56(PF9) CN11_57(PD0) CN11_58(PG1) CN11_59(PG0) CN11_60(GND_CN11) CN11_61(PE1) CN11_62(PE6) CN11_63(PG9) CN11_64(PG15) CN11_65(PG12) CN11_66(PG10) CN11_67(NC) CN11_68(PG13) CN11_69(PD9) CN11_70(PG11) CN11_71(GND_CN11) CN11_72(GND_CN11) CN12_1(PC9) CN12_2(PC8) CN12_3(PB8) CN12_4(PC6) CN12_5(PB9) CN12_6(PC5) CN12_7(AVDD_CN12) CN12_8(U5V) CN12_9(GND_CN12) CN12_10(PD8) CN12_11(PA5) CN12_12(PA12) CN12_13(PA6) CN12_14(PA11) CN12_15(PA7) CN12_16(PB12) CN12_17(PB6) CN12_18(PB11) CN12_19(PC7) CN12_20(GND_CN12) CN12_21(PA9) CN12_22(PB2) CN12_23(PA8) CN12_24(PB1) CN12_25(PB10) CN12_26(PB15) CN12_27(PB4) CN12_28(PB14) CN12_29(PB5) CN12_30(PB13) CN12_31(PB3) CN12_32(AGND_CN12) CN12_33(PA10) CN12_34(PC4) CN12_35(PA2) CN12_36(PF5) CN12_37(PA3) CN12_38(PF4) CN12_39(GND_CN12) CN12_40(PE8) CN12_41(PD13) CN12_42(PF10) CN12_43(PD12) CN12_44(PE7) CN12_45(PD11) CN12_46(PD14) CN12_47(PE10) CN12_48(PD15) CN12_49(PE12) CN12_50(PF14) CN12_51(PE14) CN12_52(PE9) CN12_53(PE15) CN12_54(GND_CN12) CN12_55(PE13) CN12_56(PE11) CN12_57(PF13) CN12_58(PF3) CN12_59(PF12) CN12_60(PF15) CN12_61(PG14) CN12_62(PF11) CN12_63(GND_CN12) CN12_64(PE0) CN12_65(PD10) CN12_66(PG8) CN12_67(PG7) CN12_68(PG5) CN12_69(PG4) CN12_70(PG6) CN12_71(GND_CN12) CN12_72(GND_CN12)

### Layout directives
net class Flying: (no net found under the mark), NetC20_2
net class Clr_to_all: (no net found under the mark)

### Notes on the sheet
- Add holes for caps
  select caps
- (near R51) Overcurrent shutdown with ~50us shutdown holdoff
- Vbus overvoltage shutdown
- Labels drawn without touching a wire or pin: IP_Relay_Ctl, ISense_Raw_U, ISense_Raw_V, ISense_Raw_W, ISense_Vref, OCDext, OCDint, OP_Relay_Ctl, PWM_EN, U_DRV_H, U_DRV_L, V_DRV_H, V_DRV_L, Vsense_Bus, Vsense_In_U, Vsense_In_V, Vsense_In_W, Vsense_U, Vsense_V, Vsense_W, W_DRV_H, W_DRV_L
- (in symbol NUCLEO-F429ZI, part A) CN11
- (in symbol NUCLEO-F429ZI, part B) CN12
- (in symbol NUCLEO-F429ZI, part C) CN8
- (in symbol NUCLEO-F429ZI, part D) CN9
- (in symbol NUCLEO-F429ZI, part E) CN7
- (in symbol NUCLEO-F429ZI, part F) CN10
- (in symbol PTV09A-2020F-B104) CW
- (in symbol TLC393IDR, part A) -; A; +
- (in symbol TLC393IDR, part B) +; B; -

### Library data of the parts
C2-C7 C52-C54 = EKXG451ELL820MMP1S: CAP, 82u, 450V, ±20%, Alu, Pol, RADIAL, THT; Manufacturer: United Chemi-Con; Manufacturer Part Number: EKXG451ELL820MMP1S; Value: 82u; Supplier 1: Digikey; Supplier Part Number 1: 565-1480-ND; Tolerance: ±20%; Temperature Coefficient: Alu, Pol; Operating Temperature: -25°C ~ 105°C; Price: 2.9; HelpURL: http://www.chemi-con.co.jp/cgi-bin/CAT_DB/SEARCH/cat_db_al.cgi?e=e&j=p&pdfname=kxg
C8-C11 C16 C17 = C4AQLBW5500A3JK: Dist: Digi-Key; Dist P/N: 399-17001-ND; Mfg: Kemet; Mfgr P/N: C4AQLBW5500A3JK; Price: 10.35; HelpURL: https://katalog.we-online.de/pbs/datasheet/885012206089.pdf
C20 C22 C33 C38 C39 C41 C48-C51 = C1608X5R1E105K: CAP, 1u, 25V, ±10%, X5R, 0603; Manufacturer: TDK; Manufacturer Part Number: C1608X5R1E105K; Value: 1u; Supplier 1: Digikey; Supplier Part Number 1: 445-5146-1-ND; Tolerance: ±10%; Temperature Coefficient: X5R; Operating Temperature: -55°C ~ 85°C; Price: 0.07; HelpURL: https://product.tdk.com/info/en/catalog/datasheets/mlcc_commercial_general_en.pdf?ref_disty=digikey
C21 C37 C40 = CL31A226KAHNNNE: CAP, 22u, 25V, ±10%, X5R, 1206; Manufacturer: Samsung; Manufacturer Part Number: CL31A226KAHNNNE; Value: 22u; Supplier 1: Digikey; Supplier Part Number 1: 1276-3047-1-ND; Tolerance: ±10%; Temperature Coefficient: X5R; Operating Temperature: -55°C ~ 85°C; Price: 0.27; HelpURL: https://media.digikey.com/pdf/Data%20Sheets/Samsung%20PDFs/CL31A226KAHNNNE_Spec.pdf
C23-C29 C44 = C0603C104K3RACTU: CAP, 100n, 25V, ±10%, X7R, 0603; Manufacturer: Kemet; Manufacturer Part Number: C0603C104K3RACTU; Value: 100n; Supplier 1: Digikey; Supplier Part Number 1: 399-1281-1-ND; Tolerance: ±10%; Temperature Coefficient: X7R; Operating Temperature: -55°C ~ 125°C; Price: 0.06; HelpURL: https://api.kemet.com/component-edge/download/datasheet/C0603C104K3RACTU.pdf
C30-C32 C43 C45-C47 = C1608C0G1H151J: CAP, 150p, 50V, ±5%, C0G, NP0, 0603, (EOL); Manufacturer: TDK; Manufacturer Part Number: C1608C0G1H151J; Value: 150p; Supplier 1: Digikey; Supplier Part Number 1: 445-1283-1-ND; Tolerance: ±5%; Temperature Coefficient: C0G, NP0; Operating Temperature: -55°C ~ 125°C; HelpURL: https://product.tdk.com/info/en/catalog/datasheets/mlcc_commercial_general_en.pdf?ref_disty=digikey
C34-C36 = 06035C562KAT2A: CAP, 5.6n, 50V, ±10%, X7R, 0603; Manufacturer: AVX; Manufacturer Part Number: 06035C562KAT2A; Value: 5.6n; Supplier 1: Digikey; Supplier Part Number 1: 478-1224-1-ND; Tolerance: ±10%; Temperature Coefficient: X7R; Operating Temperature: -55°C ~ 125°C; Price: 0.05; HelpURL: http://datasheets.avx.com/X7RDielectric.pdf
C42 = CC0603KRX7R8BB473: CAP, 47n, 25V, ±10%, X7R, 0603; Manufacturer: Yageo; Manufacturer Part Number: CC0603KRX7R8BB473; Value: 47n; Supplier 1: Digikey; Supplier Part Number 1: 311-1373-1-ND; Tolerance: ±10%; Temperature Coefficient: X7R; Operating Temperature: -55°C ~ 125°C; Price: 0.03; HelpURL: https://www.yageo.com/upload/media/product/productsearch/datasheet/mlcc/UPY-GPHC_X7R_6.3V-to-50V_18.pdf
D1 D5 D9 = VSSAF510-M3/H: DIO, SCHOTTKY, 600V, 1A, SMA; Manufacturer: Vishay; Manufacturer Part Number: ES1J-LTP; Value: ES1J-LTP; Supplier 1: Digikey; Supplier Part Number 1: ES1J-LTPMSCT-ND; Voltage - DC Reverse (Max): 600V; Current: 1A; Operating Temperature: -40°C ~ 150°C; Price: 0.28; HelpURL: https://www.mccsemi.com/pdf/Products/ES1A-L-ES1J-L(DO-214AC).pdf
D2 D4 D6 D8 D10 D12-D15 = CUS10S30,H3F: DIO, SCHOTTKY, 30V, 1A, SOD-323; Manufacturer: Toshiba Semiconductor and Storage; Manufacturer Part Number: CUS10S30,H3F; Value: CUS10S30,H3F; Supplier 1: Digikey; Supplier Part Number 1: CUS10S30H3FTR-ND; Voltage - DC Reverse (Max): 30V; Current: 1A; Operating Temperature: 125°C; Price: 0.18; HelpURL: https://toshiba.semicon-storage.com/info/docget.jsp?did=14077&prodName=CUS10S30
D3 D7 D11 = BAT54CFILM: DIO, SCHOTTKY, CC, 40V, 300mA, SOT-23-3; Manufacturer: ST; Reverse Recovery Time (trr): 5ns; Manufacturer Part Number: BAT54CFILM; Value: BAT54CFILM; Supplier 1: Digikey; Supplier Part Number 1: 497-3786-2-ND; Voltage - DC Reverse (Max): 40V; Current: 300mA; Operating Temperature: -40°C ~ 150°C; Price: 0.19; HelpURL: https://www.st.com/content/ccc/resource/technical/document/datasheet/07/50/54/f2/0d/ba/4a/79/CD00001322.pdf/files/CD00001322.pdf/jcr:content/translations/en.CD00001322.pdf
J1 = 22-29-2021: CONN, HEADER, 2-POS, 2.54mm, TH; Manufacturer: Molex; Number of Positions: 2; Voltage - Rated: 500V; Current Rating: 4A; Manufacturer Part Number: 22-29-2021; Value: 22-29-2021; Supplier 1: Digikey; Supplier Part Number 1: WM2744-ND; Pitch: 2.54mm; Number of Rows: 1; Price: 0.45; HelpURL: https://www.molex.com/pdm_docs/sd/022292021_sd.pdf
L1-L3 = BF-IND: Dist: -; Dist P/N: -; Mfg: -; Mfgr P/N: -; Price: -; HelpURL: -
P1-P8 = Conn Screw Term PCB: Mfg Part Number: 8196; Supplier Part Number: *; Price: *
Q1-Q12 = AOB290L: Dist: Digi-Key; Dist P/N: 742-SIHB105N60EF-GE3-ND; Mfg: Vishay; Mfgr P/N: SIHB105N60EF-GE3; Price: 3.00; Datasheet: https://www.vishay.com/docs/92302/sihb105n60ef.pdf
Q13 Q14 = BSS316NH6327XTSA1: Dist: Digi-Key; Dist P/N: BSS316NH6327XTSA1CT-ND; Mfg: Infineon Technologies; Mfgr P/N: BSS316NH6327XTSA1; Price: 0.62; HelpURL: https://www.infineon.com/dgdl/BSS316N_Rev2.3.pdf?folderId=db3a3043156fd573011622e10b5c1f67&fileId=db3a304330f686060130ff7ee4b07f16
R1-R6 R8-R13 = RC0603FR-074R75L: RES, 4.75R, 0.1W, 1%, 0603; Manufacturer: Yageo; Tolerance: 1.00%; Temperature Coefficient: ±200ppm/°C; Manufacturer Part Number: RC0603FR-074R75L; Value: 4.75; Supplier 1: Digikey; Supplier Part Number 1: 311-4.75HRTR-ND; Power: 0.1W; Operating Temperature: -55°C ~ 155°C; Price: 0.03; HelpURL: https://www.yageo.com/upload/media/product/productsearch/datasheet/rchip/PYu-RC_Group_51_RoHS_L_10.pdf
R7 R39 R52 = ERJ-3RQF2R2V: RES, 2.2R, 0.1W, 1%, 0603; Manufacturer: Panasonic; Tolerance: 1.00%; Temperature Coefficient: ±200ppm/°C; Manufacturer Part Number: ERJ-3RQF2R2V; Value: 2.2; Supplier 1: Digikey; Supplier Part Number 1: P2.2AJTR-ND; Power: 0.1W; Operating Temperature: -55°C ~ 155°C; Price: 0.09; HelpURL: https://industrial.panasonic.com/cdbs/www-data/pdf/RDN0000/AOA0000C313.pdf
R14-R19 R23-R25 R27-R29 R31-R33 R36-R38 R62 R63 R65 R66 R68-R74 R77-R83 R85-R90 = ERJ-3EKF1003V: RES, 100K, 0.1W, 1%, 0603; Manufacturer: Panasonic; Tolerance: 1.00%; Temperature Coefficient: ±100ppm/°C; Manufacturer Part Number: ERJ-3EKF1003V; Value: 100K; Supplier 1: Digikey; Supplier Part Number 1: P100KHTR-ND; Power: 0.1W; Operating Temperature: -55°C ~ 155°C; Price: 0.02; HelpURL: https://industrial.panasonic.com/cdbs/www-data/pdf/RDA0000/AOA0000C304.pdf
R20 R30 R43 R49 R53 R60 = ERJ-3EKF10R0V: RES, 10R, 0.1W, 1%, 0603; Manufacturer: Panasonic; Tolerance: 1.00%; Temperature Coefficient: ±100ppm/°C; Manufacturer Part Number: ERJ-3EKF10R0V; Value: 10; Supplier 1: Digikey; Supplier Part Number 1: P10.0HTR-ND; Power: 0.1W; Operating Temperature: -55°C ~ 155°C; Price: 0.02; HelpURL: https://industrial.panasonic.com/cdbs/www-data/pdf/RDA0000/AOA0000C304.pdf
R21 R22 R44 R45 R54 R56 = ERJ-3EKF4991V: RES, 4.99K, 0.1W, 1%, 0603; Manufacturer: Panasonic; Tolerance: 1.00%; Temperature Coefficient: ±100ppm/°C; Manufacturer Part Number: ERJ-3EKF4991V; Value: 4.99K; Supplier 1: Digikey; Supplier Part Number 1: P4.99KHTR-ND; Power: 0.1W; Operating Temperature: -55°C ~ 155°C; Price: 0.02; HelpURL: https://industrial.panasonic.com/cdbs/www-data/pdf/RDA0000/AOA0000C304.pdf
R26 R34 R46 R50 R57 R61 = ERJ-3EKF4992V: RES, 49.9K, 0.1W, 1%, 0603; Manufacturer: Panasonic; Tolerance: 1.00%; Temperature Coefficient: ±100ppm/°C; Manufacturer Part Number: ERJ-3EKF4992V; Value: 49.9K; Supplier 1: Digikey; Supplier Part Number 1: P49.9KHTR-ND; Power: 0.1W; Operating Temperature: -55°C ~ 155°C; Price: 0.02; HelpURL: https://industrial.panasonic.com/cdbs/www-data/pdf/RDA0000/AOA0000C304.pdf
R35 = PTV09A-2020F-B104: RES, POT, 100K, 50mW, Linear, THT; Manufacturer: Bourns Inc.; Tolerance: 20.00%; Manufacturer Part Number: PTV09A-2020F-B104; Value: 100K; Supplier 1: Digikey; Supplier Part Number 1: PTV09A-2020F-B104-ND; Power: 50mW; Price: 0.87; HelpURL: https://www.bourns.com/docs/Product-Datasheets/PTV09.pdf
R40-R42 R84 R91-R93 = ERJ-3EKF4301V: RES, 4.3K, 0.1W, 1%, 0603; Manufacturer: Panasonic; Tolerance: 1.00%; Temperature Coefficient: ±100ppm/°C; Manufacturer Part Number: ERJ-3EKF4301V; Value: 4.3K; Supplier 1: Digikey; Supplier Part Number 1: P4.30KHTR-ND; Power: 0.1W; Operating Temperature: -55°C ~ 155°C; Price: 0.02; HelpURL: https://industrial.panasonic.com/cdbs/www-data/pdf/RDA0000/AOA0000C304.pdf
R47 R48 R58 R75 R76 = ERJ-3EKF1002V: RES, 10K, 0.1W, 1%, 0603; Manufacturer: Panasonic; Tolerance: 1.00%; Temperature Coefficient: ±100ppm/°C; Manufacturer Part Number: ERJ-3EKF1002V; Value: 10K; Supplier 1: Digikey; Supplier Part Number 1: P10.0KHTR-ND; Power: 0.1W; Operating Temperature: -55°C ~ 155°C; Price: 0.02; HelpURL: https://industrial.panasonic.com/cdbs/www-data/pdf/RDA0000/AOA0000C304.pdf
R51 R55 R59 R64 = ERJ-3EKF1001V: RES, 1K, 0.1W, 1%, 0603; Manufacturer: Panasonic; Tolerance: 1.00%; Temperature Coefficient: ±100ppm/°C; Manufacturer Part Number: ERJ-3EKF1001V; Value: 1K; Supplier 1: Digikey; Supplier Part Number 1: P1.00KHTR-ND; Power: 0.1W; Operating Temperature: -55°C ~ 155°C; Price: 0.02; HelpURL: https://industrial.panasonic.com/cdbs/www-data/pdf/RDA0000/AOA0000C304.pdf
R67 = ERJ-3EKF2002V: Dist: Digi-Key; Dist P/N: P18.2KHCT-ND; Mfg: Panasonic; Mfgr P/N: ERJ-3EKF1822V; Price: 0.05
R94-R96 = ERJ-3EKF4301V: Dist: Digi-Key; Dist P/N: P4.30KHCT-ND; Mfg: Panasonic; Price: 0.05; HelpURL: http://industrial.panasonic.com/www-cgi/jvcr13pz.cgi?E+PZ+3+AOA0002+ERJ3EKF22R1V+7+WW; Mfgr P/N: ERJ-3EKF4301V
RL2-RL7 = J115F11A12VDCS6.9: Dist: Digi-Key; Dist P/N: 2449-J115F11A12VDCS6.9-ND; Mfg: CIT Relay and Switch; Mfgr P/N: J115F11A12VDCS6.9; Price: 2.02; HelpURL: https://www.citrelay.com/Catalog%20Pages/RelayCatalog/J115F1.pdf
U1-U3 = MLX91221KDF-ABF-075-SP: Dist: Digi-Key; Dist P/N: 413-MLX91221KDF-ABF-075-SP-ND; Mfg: Melexis; Mfgr P/N: MLX91221KDF-ABF-075-SP; Price: 4.45
  U1 U2: Datasheet: https://www.melexis.com/-/media/files/documents/datasheets/mlx91221-datasheet-melexis.pdf
  U3: HelpURL: https://www.melexis.com/-/media/files/documents/datasheets/mlx91221-datasheet-melexis.pdf
U4 U5 U7 = FAN7390MX: Dist: Digikey; Mfg: Fairchild; Dist P/N: FAN7390MXCT-ND; Mfg P/N: FAN7390MX; Price: 3.40; HelpURL: http://www.fairchildsemi.com/ds/FA/FAN7390.pdf
U6 = TLC393IDR: Dist: Digi-Key; Dist P/N: 296-1330-1-ND; Mfg: Texas Instruments; Datasheet: http://www.ti.com/general/docs/suppproductinfo.tsp?distId=10&gotoUrl=http%3A%2F%2Fwww.ti.com%2Flit%2Fgpn%2Ftlc393; Mfgr P/N: TLC393IDR; Price: 1.97
U8 = NUCLEO-F429ZI: STM32F429ZI, mbed-Enabled Development Nucleo-144 STM32F4 ARMÂ® CortexÂ®-M4 MCU 32-Bit Embedded Evaluation Board; MF: STMicroelectronics; Check_prices: https://www.snapeda.com/parts/NUCLEO-F429ZI/STMicroelectronics/view-part/477252/?ref=eda; Availability: Bad; Value: *; Price: None; MP: NUCLEO-F429ZI; SnapEDA_Link: https://www.snapeda.com/parts/NUCLEO-F429ZI/STMicroelectronics/view-part/477252/?ref=snap; Package: None; Purchase-URL: https://pricing.snapeda.com/search/part/NUCLEO-F429ZI/?ref=eda
U9 = ZLDO1117K33TC: IC, REG, LDO, Fixed, 3.3V, 1A, TO-252-3; Manufacturer: Diodes Incorporated; Voltage - Input: 18V; Voltage - Dropout: 1.35V @ 1A; Number of Regulators: 1; PSRR: 80dB (120Hz); Manufacturer Part Number: ZLDO1117K33TC; Supplier 1: Digikey; Supplier Part Number 1: ZLDO1117K33DICT-ND; Regulator Topology: Fixed; Operating Temperature: -40°C ~ 125°C; Price: 0.517; Value: ZLDO1117K33TC; HelpURL: https://www.diodes.com/assets/Datasheets/ZLDO1117.pdf
U10 = ZLDO1117G50TA: IC, REG, LDO, Fixed, 5V, 1A, SOT-223-4; Manufacturer: Diodes Incorporated; Voltage - Input: 18V; Voltage - Dropout: 1.35V @ 1A; Number of Regulators: 1; PSRR: 80dB (120Hz); Manufacturer Part Number: ZLDO1117G50TA; Supplier 1: Digikey; Supplier Part Number 1: ZLDO1117G50DICT-ND; Regulator Topology: Fixed; Operating Temperature: -40°C ~ 125°C; Price: 0.4375; Value: ZLDO1117G50TA; HelpURL: https://www.diodes.com/assets/Datasheets/ZLDO1117.pdf

## Assembly variants
Prototype: not fitted C2 C3 C4 C5 C6 C7 C8 C9 C10 C11 C16 C17 C52 C53 C54 L1 L2 L3 P1 P2 P3 P4 P5 P6 P7 P8 RL2 RL3 RL4 RL5 RL6 RL7 U8